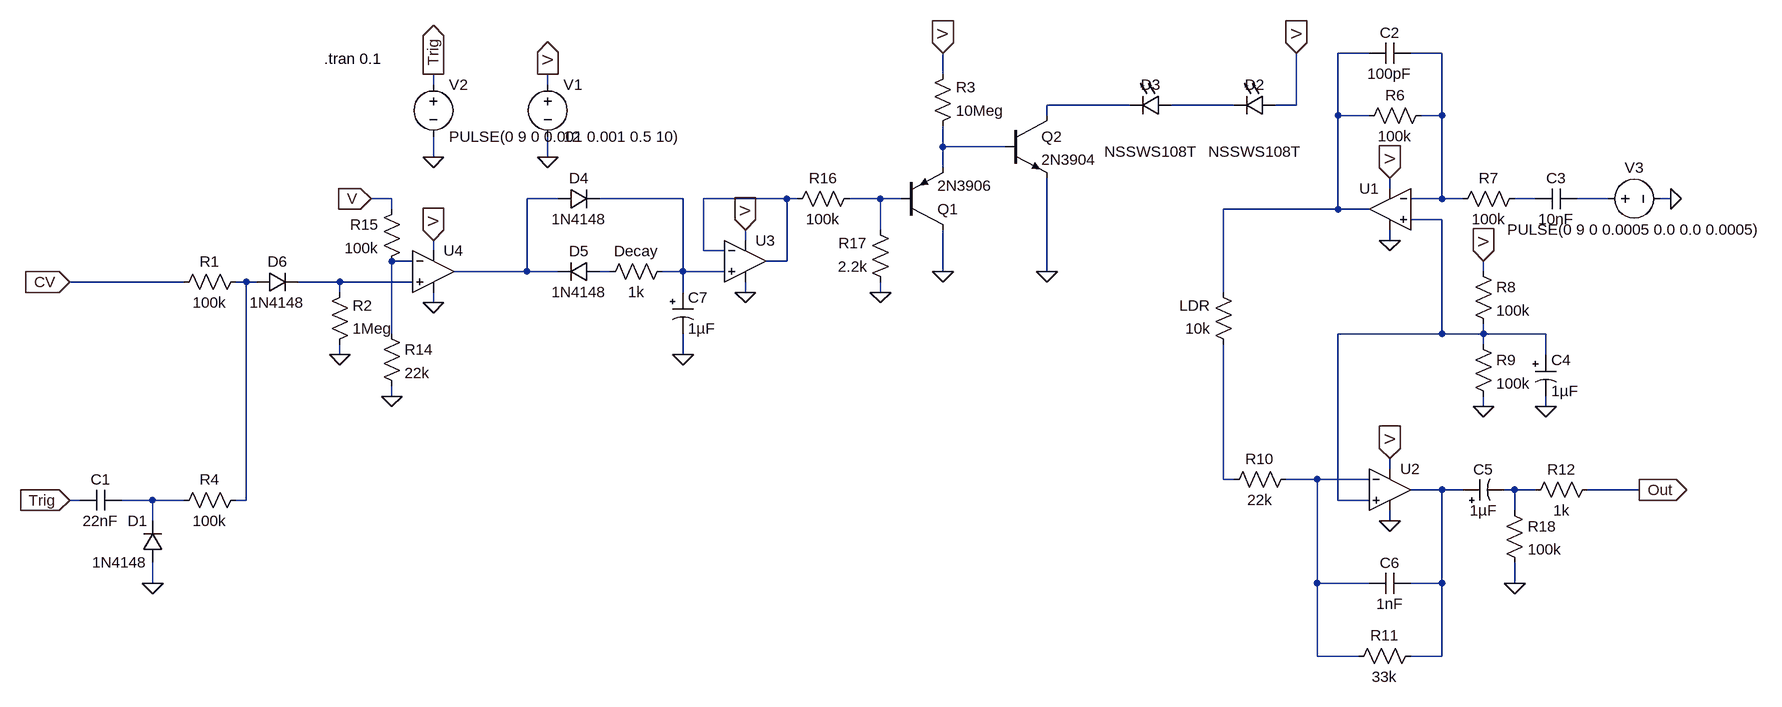
[diagram p0: schematic LPG_VCA_Env.asc]
LPG_VCA_Env.asc, the LTspice schematic file:
Version 4
SHEET 1 1416 824
WIRE 800 -144 752 -144
WIRE 912 -144 864 -144
WIRE 144 -112 144 -144
WIRE -640 -96 -640 -112
WIRE -464 -96 -464 -112
WIRE 432 -64 304 -64
WIRE 592 -64 496 -64
WIRE 688 -64 688 -144
WIRE 688 -64 656 -64
WIRE 304 -48 304 -64
WIRE 752 -48 752 -144
WIRE 800 -48 752 -48
WIRE 912 -48 912 -144
WIRE 912 -48 880 -48
WIRE 144 0 144 -32
WIRE 240 0 144 0
WIRE -640 16 -640 -16
WIRE -464 16 -464 -16
WIRE 144 32 144 0
WIRE 832 64 832 48
WIRE -704 80 -736 80
WIRE -448 80 -496 80
WIRE -256 80 -384 80
WIRE -96 80 -224 80
WIRE -80 80 -96 80
WIRE 48 80 0 80
WIRE 80 80 48 80
WIRE 304 192 304 48
WIRE 912 80 912 -48
WIRE 912 80 864 80
WIRE 944 80 912 80
WIRE 1056 80 1024 80
WIRE 1168 80 1120 80
WIRE 1264 80 1248 80
WIRE -704 96 -704 80
WIRE 752 96 752 -48
WIRE 752 96 576 96
WIRE 800 96 752 96
WIRE 912 112 864 112
WIRE 48 128 48 80
WIRE -160 144 -160 128
WIRE 832 144 832 128
WIRE -640 160 -640 144
WIRE -224 160 -224 80
WIRE -192 160 -224 160
WIRE -672 176 -704 176
WIRE -96 176 -96 80
WIRE -96 176 -128 176
WIRE -496 192 -496 80
WIRE -496 192 -608 192
WIRE -448 192 -496 192
WIRE -368 192 -384 192
WIRE -256 192 -256 80
WIRE -256 192 -288 192
WIRE -192 192 -256 192
WIRE 144 192 144 128
WIRE 976 192 976 176
WIRE -1024 208 -1200 208
WIRE -928 208 -944 208
WIRE -912 208 -928 208
WIRE -784 208 -848 208
WIRE -672 208 -784 208
WIRE -784 224 -784 208
WIRE -256 224 -256 192
WIRE -160 224 -160 208
WIRE 48 224 48 208
WIRE 576 224 576 96
WIRE -640 240 -640 224
WIRE -704 288 -704 176
WIRE 912 288 912 112
WIRE 912 288 752 288
WIRE 976 288 976 272
WIRE 976 288 912 288
WIRE 1072 288 976 288
WIRE 976 304 976 288
WIRE -784 320 -784 304
WIRE -256 320 -256 288
WIRE 1072 320 1072 288
WIRE -704 384 -704 368
WIRE 976 400 976 384
WIRE 1072 400 1072 384
WIRE 832 496 832 480
WIRE 576 512 576 304
WIRE 592 512 576 512
WIRE 720 512 672 512
WIRE 800 512 720 512
WIRE 912 528 864 528
WIRE 944 528 912 528
WIRE 1024 528 1008 528
WIRE 1056 528 1024 528
WIRE 1216 528 1136 528
WIRE -1184 544 -1200 544
WIRE -1072 544 -1120 544
WIRE -1024 544 -1072 544
WIRE -928 544 -928 208
WIRE -928 544 -944 544
WIRE 752 544 752 288
WIRE 800 544 752 544
WIRE 1024 560 1024 528
WIRE -1072 576 -1072 544
WIRE 832 576 832 560
WIRE -1072 672 -1072 640
WIRE 720 672 720 512
WIRE 800 672 720 672
WIRE 912 672 912 528
WIRE 912 672 864 672
WIRE 1024 672 1024 640
WIRE 720 784 720 672
WIRE 784 784 720 784
WIRE 912 784 912 672
WIRE 912 784 864 784
FLAG 304 192 0
FLAG 144 192 0
FLAG -464 16 0
FLAG -464 -112 V
IOPIN -464 -112 Out
FLAG 144 -144 V
IOPIN 144 -144 In
FLAG -1200 208 CV
IOPIN -1200 208 In
FLAG -1072 672 0
FLAG -1200 544 Trig
IOPIN -1200 544 In
FLAG -640 16 0
FLAG -640 -112 Trig
IOPIN -640 -112 Out
FLAG 688 -144 V
IOPIN 688 -144 In
FLAG 832 144 0
FLAG 832 48 V
IOPIN 832 48 In
FLAG 1264 80 0
FLAG 976 176 V
IOPIN 976 176 In
FLAG 976 400 0
FLAG 1072 400 0
FLAG 832 576 0
FLAG 832 480 V
IOPIN 832 480 In
FLAG 1216 528 Out
IOPIN 1216 528 Out
FLAG -160 224 0
FLAG -160 128 V
IOPIN -160 128 In
FLAG -256 320 0
FLAG -784 320 0
FLAG -640 240 0
FLAG -640 144 V
IOPIN -640 144 In
FLAG -704 384 0
FLAG -736 80 V
IOPIN -736 80 In
FLAG 48 224 0
FLAG 1024 672 0
SYMBOL res -928 192 R90
WINDOW 0 0 56 VBottom 2
WINDOW 3 32 56 VTop 2
SYMATTR InstName R1
SYMATTR Value 100k
SYMBOL pnp 80 128 M180
SYMATTR InstName Q1
SYMATTR Value 2N3906
SYMBOL npn 240 -48 R0
SYMATTR InstName Q2
SYMATTR Value 2N3904
SYMBOL res 128 -16 M180
WINDOW 0 36 76 Left 2
WINDOW 3 36 40 Left 2
SYMATTR InstName R3
SYMATTR Value 10Meg
SYMBOL voltage -464 -112 R0
SYMATTR InstName V1
SYMATTR Value 12
SYMBOL cap -1120 528 R90
WINDOW 0 0 32 VBottom 2
WINDOW 3 32 32 VTop 2
SYMATTR InstName C1
SYMATTR Value 22nF
SYMBOL diode -1056 640 R180
WINDOW 0 24 64 Left 2
WINDOW 3 24 0 Left 2
SYMATTR InstName D1
SYMATTR Value 1N4148
SYMBOL res -928 528 R90
WINDOW 0 0 56 VBottom 2
WINDOW 3 32 56 VTop 2
SYMATTR InstName R4
SYMATTR Value 100k
SYMBOL voltage -640 -112 R0
SYMATTR InstName V2
SYMATTR Value PULSE(0 9 0 0.001 0.001 0.5 10)
SYMBOL LED 656 -80 R90
WINDOW 0 0 32 VBottom 2
WINDOW 3 72 32 VTop 2
SYMATTR InstName D2
SYMATTR Value NSSWS108T
SYMBOL LED 496 -80 R90
WINDOW 0 0 32 VBottom 2
WINDOW 3 72 32 VTop 2
SYMATTR InstName D3
SYMATTR Value NSSWS108T
SYMBOL res 592 320 R180
WINDOW 0 36 76 Left 2
WINDOW 3 36 40 Left 2
SYMATTR InstName LDR
SYMATTR Value 10k
SYMBOL Opamps/UniversalOpamp2 832 96 M0
SYMATTR InstName U1
SYMBOL res 896 -64 R90
WINDOW 0 0 56 VBottom 2
WINDOW 3 32 56 VTop 2
SYMATTR InstName R6
SYMATTR Value 100k
SYMBOL cap 864 -160 R90
WINDOW 0 0 32 VBottom 2
WINDOW 3 32 32 VTop 2
SYMATTR InstName C2
SYMATTR Value 100pF
SYMBOL res 1040 64 R90
WINDOW 0 0 56 VBottom 2
WINDOW 3 32 56 VTop 2
SYMATTR InstName R7
SYMATTR Value 100k
SYMBOL cap 1120 64 R90
WINDOW 0 0 32 VBottom 2
WINDOW 3 32 32 VTop 2
SYMATTR InstName C3
SYMATTR Value 10nF
SYMBOL voltage 1152 80 R270
WINDOW 0 32 56 VTop 2
WINDOW 3 -32 56 VBottom 2
SYMATTR InstName V3
SYMATTR Value PULSE(0 9 0 0.0005 0.0 0.0 0.0005)
SYMBOL res 960 176 R0
SYMATTR InstName R8
SYMATTR Value 100k
SYMBOL res 960 288 R0
SYMATTR InstName R9
SYMATTR Value 100k
SYMBOL polcap 1056 320 R0
SYMATTR InstName C4
SYMATTR Value 1µF
SYMBOL Opamps/UniversalOpamp2 832 528 R0
SYMATTR InstName U2
SYMBOL polcap 944 544 R270
WINDOW 0 32 32 VTop 2
WINDOW 3 0 32 VBottom 2
SYMATTR InstName C5
SYMATTR Value 1µF
SYMBOL res 688 496 R90
WINDOW 0 0 56 VBottom 2
WINDOW 3 32 56 VTop 2
SYMATTR InstName R10
SYMATTR Value 22k
SYMBOL cap 864 656 R90
WINDOW 0 0 32 VBottom 2
WINDOW 3 32 32 VTop 2
SYMATTR InstName C6
SYMATTR Value 1nF
SYMBOL res 880 768 R90
WINDOW 0 0 56 VBottom 2
WINDOW 3 32 56 VTop 2
SYMATTR InstName R11
SYMATTR Value 33k
SYMBOL diode -448 96 R270
WINDOW 0 32 32 VTop 2
WINDOW 3 0 32 VBottom 2
SYMATTR InstName D4
SYMATTR Value 1N4148
SYMBOL diode -384 208 M270
WINDOW 0 32 32 VTop 2
WINDOW 3 0 32 VBottom 2
SYMATTR InstName D5
SYMATTR Value 1N4148
SYMBOL res -272 176 R90
WINDOW 0 0 56 VBottom 2
WINDOW 3 32 56 VTop 2
SYMATTR InstName Decay
SYMATTR Value 1k
SYMBOL Opamps/UniversalOpamp2 -160 176 R0
SYMATTR InstName U3
SYMBOL res -800 320 M180
WINDOW 0 36 76 Left 2
WINDOW 3 36 40 Left 2
SYMATTR InstName R2
SYMATTR Value 1Meg
SYMBOL Opamps/UniversalOpamp2 -640 192 R0
SYMATTR InstName U4
SYMBOL res -720 272 R0
SYMATTR InstName R14
SYMATTR Value 22k
SYMBOL res -688 80 M0
SYMATTR InstName R15
SYMATTR Value 100k
SYMBOL diode -912 224 R270
WINDOW 0 32 32 VTop 2
WINDOW 3 0 32 VBottom 2
SYMATTR InstName D6
SYMATTR Value 1N4148
SYMBOL res 16 64 R90
WINDOW 0 0 56 VBottom 2
WINDOW 3 32 56 VTop 2
SYMATTR InstName R16
SYMATTR Value 100k
SYMBOL res 64 224 R180
WINDOW 0 36 76 Left 2
WINDOW 3 36 40 Left 2
SYMATTR InstName R17
SYMATTR Value 2.2k
SYMBOL polcap -272 224 R0
SYMATTR InstName C7
SYMATTR Value 1µF
SYMBOL res 1152 512 R90
WINDOW 0 0 56 VBottom 2
WINDOW 3 32 56 VTop 2
SYMATTR InstName R12
SYMATTR Value 1k
SYMBOL res 1008 544 R0
SYMATTR InstName R18
SYMATTR Value 100k
TEXT -808 -136 Left 2 !.tran 0.1

The netlist it stands for:
* LPG_VCA_Env.asc
R1 N015 CV 100k
Q1 0 N009 N005 0 2N3906
Q2 N003 N005 0 0 2N3904
R3 N005 V 10Meg
V1 V 0 12
C1 N021 Trig 22nF
D1 0 N021 1N4148
R4 N015 N021 100k
V2 Trig 0 PULSE(0 9 0 0.001 0.001 0.5 10)
D2 V N004 NSSWS108T
D3 N004 N003 NSSWS108T
R§LDR N017 N001 10k
XU1 N012 N002 V 0 N001 level.2 Avol=1Meg GBW=10Meg Slew=10Meg ilimit=25m rail=0 Vos=0 phimargin=45 en=0 enk=0 in=0 ink=0 Rin=500Meg  ; pins IN+ IN- V+ V- OUT
R6 N002 N001 100k
C2 N002 N001 100pF
R7 N010 N002 100k
C3 N011 N010 10nF
V3 N011 0 PULSE(0 9 0 0.0005 0.0 0.0 0.0005)
R8 V N012 100k
R9 N012 0 100k
C4 N012 0 1µF
XU2 N012 N018 V 0 N019 level.2 Avol=1Meg GBW=10Meg Slew=10Meg ilimit=25m rail=0 Vos=0 phimargin=45 en=0 enk=0 in=0 ink=0 Rin=500Meg  ; pins IN+ IN- V+ V- OUT
C5 N019 N020 1µF
R10 N018 N017 22k
C6 N019 N018 1nF
R11 N019 N018 33k
D4 N006 N007 1N4148
D5 N014 N006 1N4148
R§Decay N007 N014 1k
XU3 N007 N008 V 0 N008 level.2 Avol=1Meg GBW=10Meg Slew=10Meg ilimit=25m rail=0 Vos=0 phimargin=45 en=0 enk=0 in=0 ink=0 Rin=500Meg  ; pins IN+ IN- V+ V- OUT
R2 0 N016 1Meg
XU4 N016 N013 V 0 N006 level.2 Avol=1Meg GBW=10Meg Slew=10Meg ilimit=25m rail=0 Vos=0 phimargin=45 en=0 enk=0 in=0 ink=0 Rin=500Meg  ; pins IN+ IN- V+ V- OUT
R14 N013 0 22k
R15 V N013 100k
D6 N015 N016 1N4148
R16 N009 N008 100k
R17 0 N009 2.2k
C7 N007 0 1µF
R12 Out N020 1k
R18 N020 0 100k
.model D D
.lib standard.dio
.model NPN NPN
.model PNP PNP
.lib standard.bjt
.tran 0.1
.lib UniversalOpamps2.sub
.backanno
.end